# Altium project vga-wing.PrjPcb
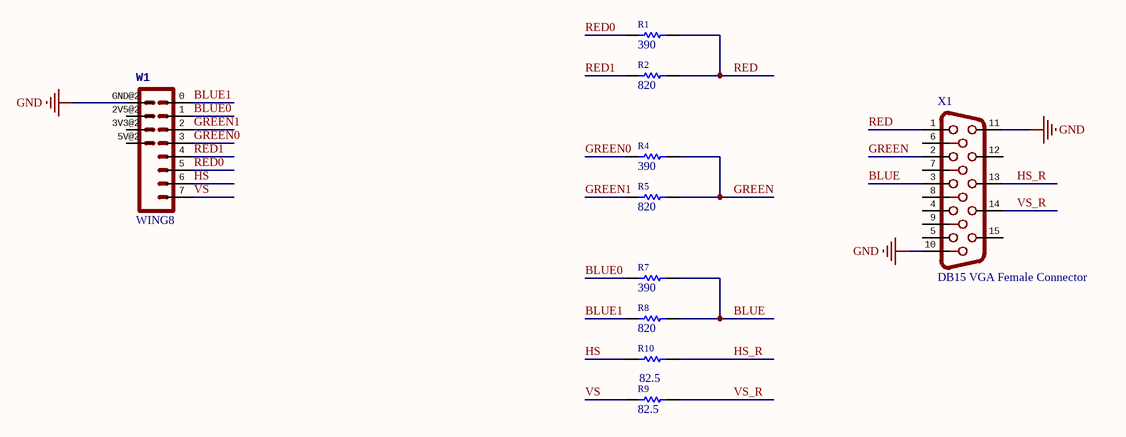
[diagram p0: vga-wing.SchDoc]
1 sheet, 10 parts. Net scope: global (net labels, ports and power ports of the same name join across sheets).
Board file: vga-wing.PcbDoc

## Sheet vga-wing.SchDoc: Posedge VGA 6-bits Wing
size A4; Organization: www.posedge.ir; Address1: Rayan-Sanat Tech.; Address2: Isfahan Science and; Address3: Technology Town, Isfahan; Address4: IRAN

### Parts
R1  390  [R0805_M]
R2  820  [R0805_M]
R4  390  [R0805_M]
R5  820  [R0805_M]
R7  390  [R0805_M]
R8  820  [R0805_M]
R9  82.5  [R0805_M]
R10  82.5  [R0805_M]
W1  WING8  [WINGSIDE_8BIT]
X1  DB15 VGA Female Connector  [HDF15H]

### Nets
GND: W1.GND@2(GND) X1.10 X1.11
BLUE: R7.1 R8.1 X1.3
BLUE0: R7.2 W1.1
BLUE1: R8.2 W1.0
GREEN: R4.1 R5.1 X1.2
GREEN0: R4.2 W1.3
GREEN1: R5.2 W1.2
HS: R10.2 W1.6
HS_R: R10.1 X1.13
RED: R1.1 R2.1 X1.1
RED0: R1.2 W1.5
RED1: R2.2 W1.4
VS: R9.2 W1.7
VS_R: R9.1 X1.14

Not connected (* = marked no-connect by the designer): W1 2V5@2(2V5) 3V3@2(3V3) 5V@2(5V); X1 4 5 6 7 8 9 12 15

### Notes on the sheet
- Title
- Size:
- Date:
- A4
- Number:
- Revision:
- Sheet
- of

### Library data of the parts
R1 R2 R4 R5 R7-R10 = R0805: Chip Resistor size 0805
  R1 R4 R7: Value: 390
  R2 R5 R8: Value: 820
  R9 R10: Value: 82.5
X1 = HF15H: OC_FARNELL: unknown; OC_NEWARK: unknown